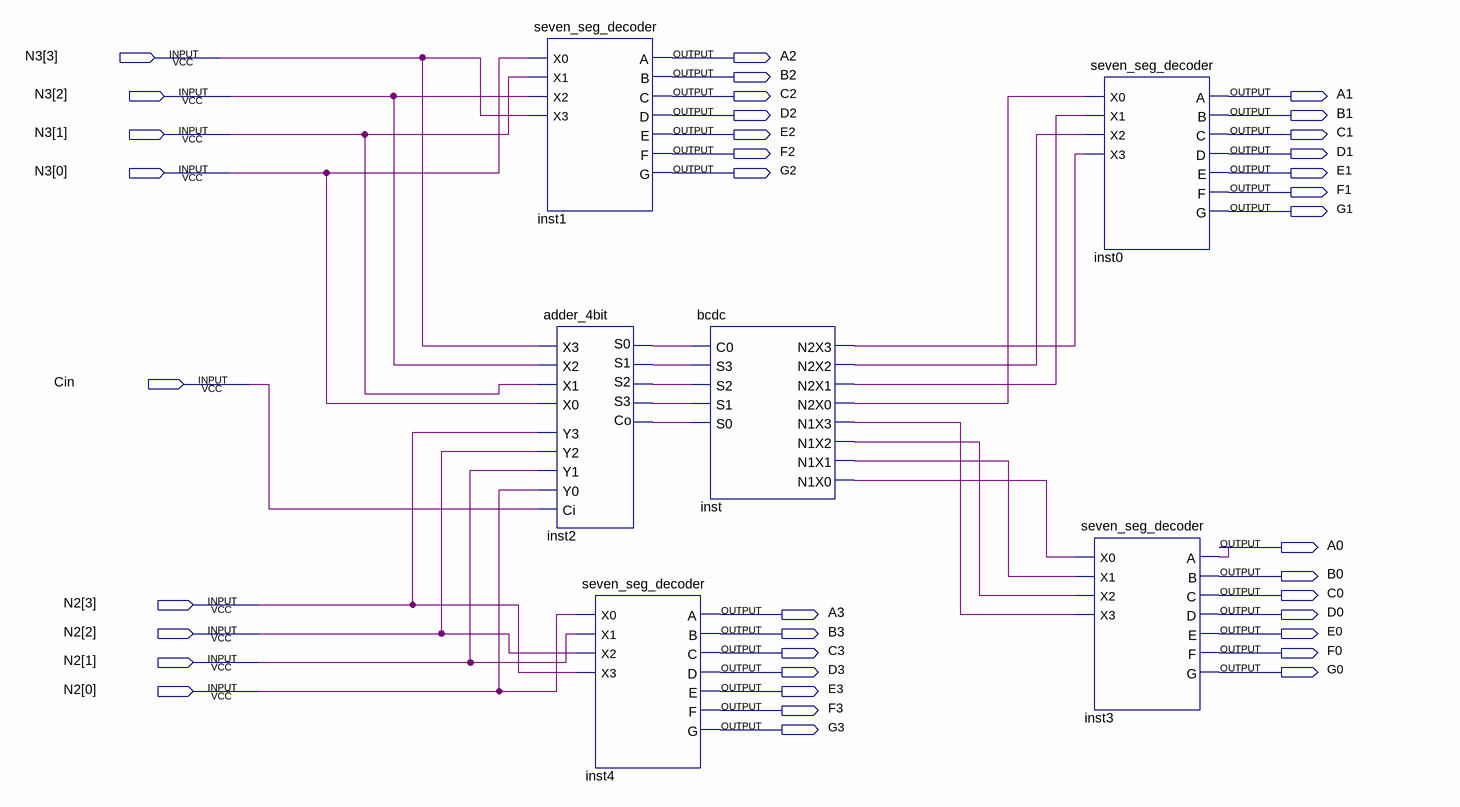
[diagram p0: schematic sheet]
// Quartus schematic lab6step0.bdf as structural Verilog: 6 symbols, 37 pins
module lab6step0 (
  input  [3:0] N3,
  input  Cin,
  input  [3:0] N2,
  output A2,
  output B2,
  output C2,
  output A1,
  output D2,
  output B1,
  output E2,
  output C1,
  output F2,
  output D1,
  output G2,
  output E1,
  output F1,
  output G1,
  output A0,
  output B0,
  output C0,
  output A3,
  output D0,
  output B3,
  output E0,
  output C3,
  output F0,
  output D3,
  output G0,
  output E3,
  output F3,
  output G3
);

  wire inst2_co, inst2_s0, inst2_s1, inst2_s2, inst2_s3, inst_n1x0, inst_n1x1, inst_n1x2, inst_n1x3,
       inst_n2x0, inst_n2x1, inst_n2x2, inst_n2x3;

  seven_seg_decoder inst1 (
    .X0(N3[0]), .X1(N3[1]), .X2(N3[2]), .X3(N3[3]), .A(A2), .B(B2), .C(C2), .D(D2), .E(E2), .F(F2), .G(G2));
  adder_4bit inst2 (
    .X3(N3[3]), .Y3(N2[3]), .X2(N3[2]), .Y2(N2[2]), .X1(N3[1]), .Y1(N2[1]), .X0(N3[0]), .Y0(N2[0]), .Ci(Cin),
    .S0(inst2_s0), .S1(inst2_s1), .S2(inst2_s2), .S3(inst2_s3), .Co(inst2_co));
  seven_seg_decoder inst4 (
    .X0(N2[0]), .X1(N2[1]), .X2(N2[2]), .X3(N2[3]), .A(A3), .B(B3), .C(C3), .D(D3), .E(E3), .F(F3), .G(G3));
  bcdc inst (
    .C0(inst2_s0), .S3(inst2_s1), .S2(inst2_s2), .S1(inst2_s3), .S0(inst2_co), .N2X3(inst_n2x3),
    .N2X2(inst_n2x2), .N2X1(inst_n2x1), .N2X0(inst_n2x0), .N1X3(inst_n1x3), .N1X2(inst_n1x2),
    .N1X1(inst_n1x1), .N1X0(inst_n1x0));
  seven_seg_decoder inst0 (
    .X0(inst_n2x0), .X1(inst_n2x1), .X2(inst_n2x2), .X3(inst_n2x3), .A(A1), .B(B1), .C(C1), .D(D1), .E(E1),
    .F(F1), .G(G1));
  seven_seg_decoder inst3 (
    .X0(inst_n1x0), .X1(inst_n1x1), .X2(inst_n1x2), .X3(inst_n1x3), .A(A0), .B(B0), .C(C0), .D(D0), .E(E0),
    .F(F0), .G(G0));
endmodule
